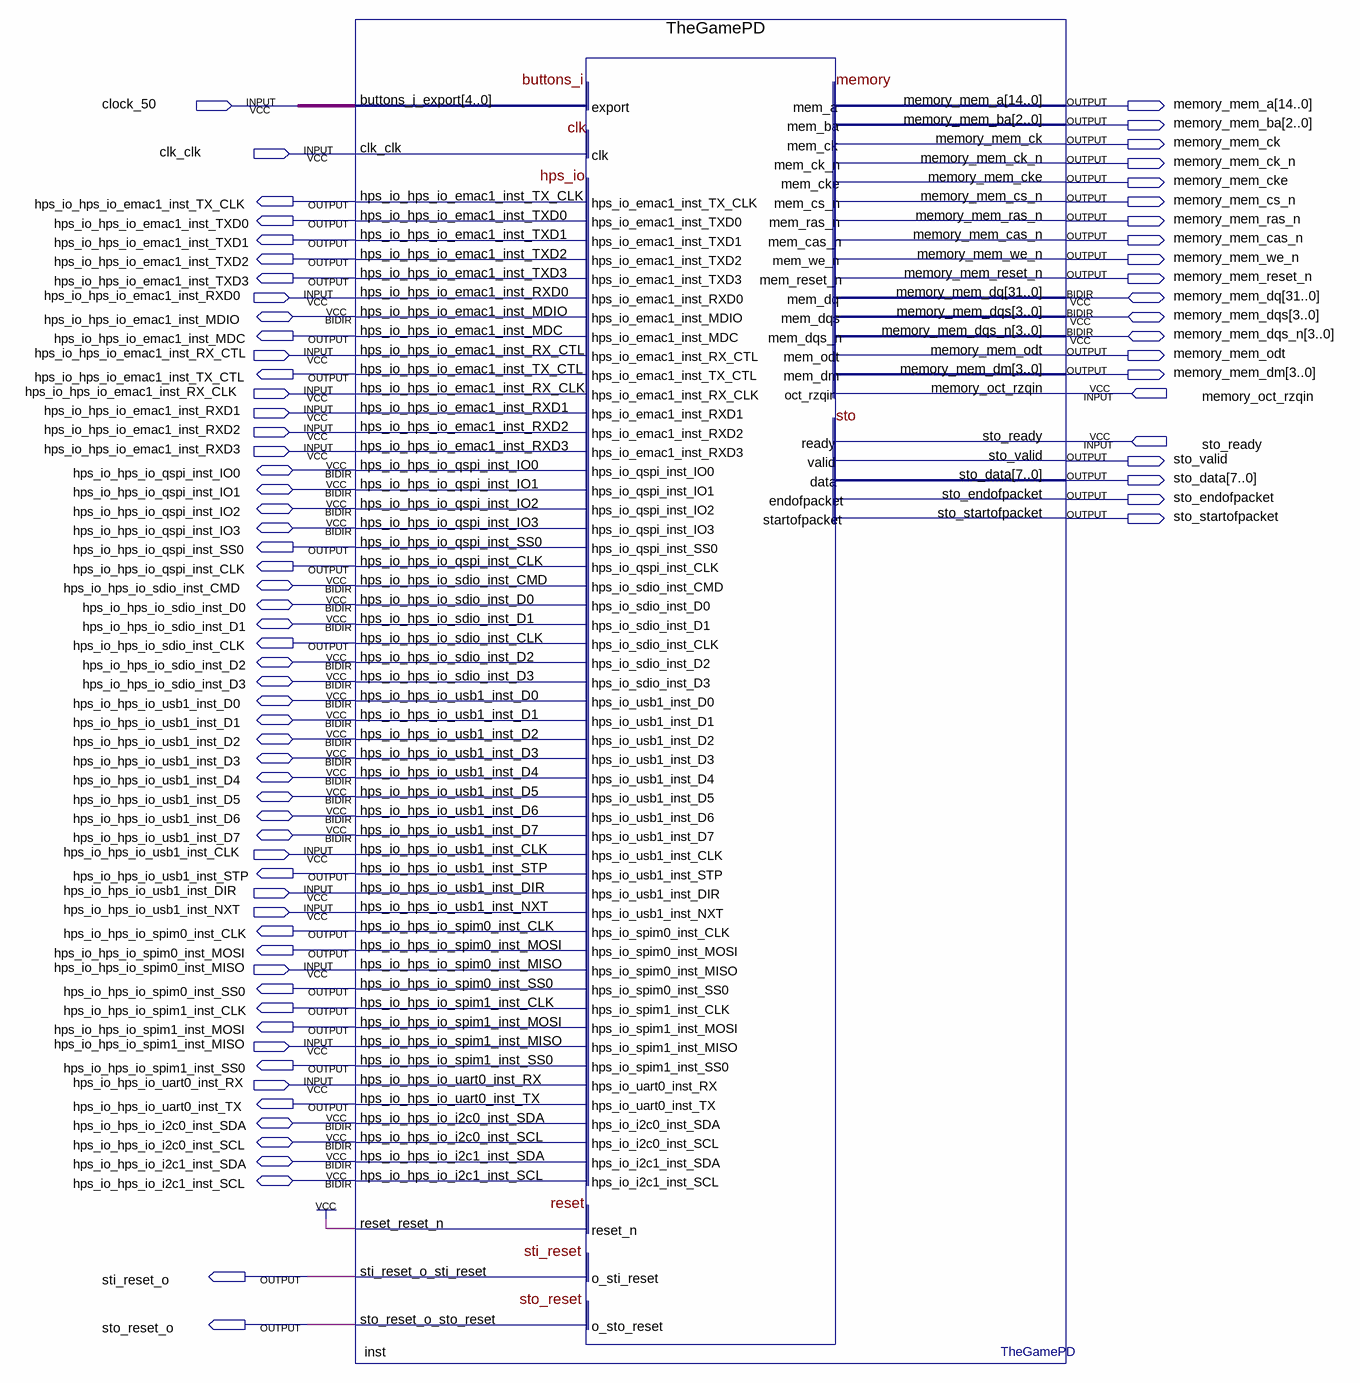
[diagram p0: schematic sheet]
// Quartus schematic theGame.bdf as structural Verilog: 1 symbols, 77 pins
module theGame (
  input  clock_50,
  input  clk_clk,
  input  hps_io_hps_io_emac1_inst_RXD0,
  input  hps_io_hps_io_emac1_inst_RX_CTL,
  input  hps_io_hps_io_emac1_inst_RX_CLK,
  input  memory_oct_rzqin,
  input  hps_io_hps_io_emac1_inst_RXD1,
  input  hps_io_hps_io_emac1_inst_RXD2,
  input  sto_ready,
  input  hps_io_hps_io_emac1_inst_RXD3,
  input  hps_io_hps_io_usb1_inst_CLK,
  input  hps_io_hps_io_usb1_inst_DIR,
  input  hps_io_hps_io_usb1_inst_NXT,
  input  hps_io_hps_io_spim0_inst_MISO,
  input  hps_io_hps_io_spim1_inst_MISO,
  input  hps_io_hps_io_uart0_inst_RX,
  inout  [31:0] memory_mem_dq,
  inout  hps_io_hps_io_emac1_inst_MDIO,
  inout  [3:0] memory_mem_dqs,
  inout  [3:0] memory_mem_dqs_n,
  inout  hps_io_hps_io_qspi_inst_IO0,
  inout  hps_io_hps_io_qspi_inst_IO1,
  inout  hps_io_hps_io_qspi_inst_IO2,
  inout  hps_io_hps_io_qspi_inst_IO3,
  inout  hps_io_hps_io_sdio_inst_CMD,
  inout  hps_io_hps_io_sdio_inst_D0,
  inout  hps_io_hps_io_sdio_inst_D1,
  inout  hps_io_hps_io_sdio_inst_D2,
  inout  hps_io_hps_io_sdio_inst_D3,
  inout  hps_io_hps_io_usb1_inst_D0,
  inout  hps_io_hps_io_usb1_inst_D1,
  inout  hps_io_hps_io_usb1_inst_D2,
  inout  hps_io_hps_io_usb1_inst_D3,
  inout  hps_io_hps_io_usb1_inst_D4,
  inout  hps_io_hps_io_usb1_inst_D5,
  inout  hps_io_hps_io_usb1_inst_D6,
  inout  hps_io_hps_io_usb1_inst_D7,
  inout  hps_io_hps_io_i2c0_inst_SDA,
  inout  hps_io_hps_io_i2c0_inst_SCL,
  inout  hps_io_hps_io_i2c1_inst_SDA,
  inout  hps_io_hps_io_i2c1_inst_SCL,
  output [14:0] memory_mem_a,
  output [2:0] memory_mem_ba,
  output memory_mem_ck,
  output memory_mem_ck_n,
  output memory_mem_cke,
  output hps_io_hps_io_emac1_inst_TX_CLK,
  output memory_mem_cs_n,
  output hps_io_hps_io_emac1_inst_TXD0,
  output memory_mem_ras_n,
  output hps_io_hps_io_emac1_inst_TXD1,
  output memory_mem_cas_n,
  output hps_io_hps_io_emac1_inst_TXD2,
  output memory_mem_we_n,
  output hps_io_hps_io_emac1_inst_TXD3,
  output memory_mem_reset_n,
  output hps_io_hps_io_emac1_inst_MDC,
  output memory_mem_odt,
  output hps_io_hps_io_emac1_inst_TX_CTL,
  output [3:0] memory_mem_dm,
  output sto_valid,
  output [7:0] sto_data,
  output sto_endofpacket,
  output sto_startofpacket,
  output hps_io_hps_io_qspi_inst_SS0,
  output hps_io_hps_io_qspi_inst_CLK,
  output hps_io_hps_io_sdio_inst_CLK,
  output hps_io_hps_io_usb1_inst_STP,
  output hps_io_hps_io_spim0_inst_CLK,
  output hps_io_hps_io_spim0_inst_MOSI,
  output hps_io_hps_io_spim0_inst_SS0,
  output hps_io_hps_io_spim1_inst_CLK,
  output hps_io_hps_io_spim1_inst_MOSI,
  output hps_io_hps_io_spim1_inst_SS0,
  output hps_io_hps_io_uart0_inst_TX,
  output sti_reset_o,
  output sto_reset_o
);

  wire [4:0] undriven;

  TheGamePD inst (
    .buttons_i_export(undriven), .clk_clk(clk_clk),
    .hps_io_hps_io_emac1_inst_RXD0(hps_io_hps_io_emac1_inst_RXD0),
    .hps_io_hps_io_emac1_inst_RX_CTL(hps_io_hps_io_emac1_inst_RX_CTL),
    .hps_io_hps_io_emac1_inst_RX_CLK(hps_io_hps_io_emac1_inst_RX_CLK),
    .hps_io_hps_io_emac1_inst_RXD1(hps_io_hps_io_emac1_inst_RXD1),
    .hps_io_hps_io_emac1_inst_RXD2(hps_io_hps_io_emac1_inst_RXD2),
    .hps_io_hps_io_emac1_inst_RXD3(hps_io_hps_io_emac1_inst_RXD3),
    .hps_io_hps_io_usb1_inst_CLK(hps_io_hps_io_usb1_inst_CLK),
    .hps_io_hps_io_usb1_inst_DIR(hps_io_hps_io_usb1_inst_DIR),
    .hps_io_hps_io_usb1_inst_NXT(hps_io_hps_io_usb1_inst_NXT),
    .hps_io_hps_io_spim0_inst_MISO(hps_io_hps_io_spim0_inst_MISO),
    .hps_io_hps_io_spim1_inst_MISO(hps_io_hps_io_spim1_inst_MISO),
    .hps_io_hps_io_uart0_inst_RX(hps_io_hps_io_uart0_inst_RX), .memory_oct_rzqin(memory_oct_rzqin),
    .reset_reset_n(1'b1), .sto_ready(sto_ready),
    .hps_io_hps_io_emac1_inst_TX_CLK(hps_io_hps_io_emac1_inst_TX_CLK),
    .hps_io_hps_io_emac1_inst_TXD0(hps_io_hps_io_emac1_inst_TXD0),
    .hps_io_hps_io_emac1_inst_TXD1(hps_io_hps_io_emac1_inst_TXD1),
    .hps_io_hps_io_emac1_inst_TXD2(hps_io_hps_io_emac1_inst_TXD2),
    .hps_io_hps_io_emac1_inst_TXD3(hps_io_hps_io_emac1_inst_TXD3),
    .hps_io_hps_io_emac1_inst_MDC(hps_io_hps_io_emac1_inst_MDC),
    .hps_io_hps_io_emac1_inst_TX_CTL(hps_io_hps_io_emac1_inst_TX_CTL),
    .hps_io_hps_io_qspi_inst_SS0(hps_io_hps_io_qspi_inst_SS0),
    .hps_io_hps_io_qspi_inst_CLK(hps_io_hps_io_qspi_inst_CLK),
    .hps_io_hps_io_sdio_inst_CLK(hps_io_hps_io_sdio_inst_CLK),
    .hps_io_hps_io_usb1_inst_STP(hps_io_hps_io_usb1_inst_STP),
    .hps_io_hps_io_spim0_inst_CLK(hps_io_hps_io_spim0_inst_CLK),
    .hps_io_hps_io_spim0_inst_MOSI(hps_io_hps_io_spim0_inst_MOSI),
    .hps_io_hps_io_spim0_inst_SS0(hps_io_hps_io_spim0_inst_SS0),
    .hps_io_hps_io_spim1_inst_CLK(hps_io_hps_io_spim1_inst_CLK),
    .hps_io_hps_io_spim1_inst_MOSI(hps_io_hps_io_spim1_inst_MOSI),
    .hps_io_hps_io_spim1_inst_SS0(hps_io_hps_io_spim1_inst_SS0),
    .hps_io_hps_io_uart0_inst_TX(hps_io_hps_io_uart0_inst_TX), .memory_mem_a(memory_mem_a),
    .memory_mem_ba(memory_mem_ba), .memory_mem_ck(memory_mem_ck), .memory_mem_ck_n(memory_mem_ck_n),
    .memory_mem_cke(memory_mem_cke), .memory_mem_cs_n(memory_mem_cs_n), .memory_mem_ras_n(memory_mem_ras_n),
    .memory_mem_cas_n(memory_mem_cas_n), .memory_mem_we_n(memory_mem_we_n),
    .memory_mem_reset_n(memory_mem_reset_n), .memory_mem_odt(memory_mem_odt), .memory_mem_dm(memory_mem_dm),
    .sti_reset_o_sti_reset(sti_reset_o), .sto_valid(sto_valid), .sto_data(sto_data),
    .sto_endofpacket(sto_endofpacket), .sto_startofpacket(sto_startofpacket),
    .sto_reset_o_sto_reset(sto_reset_o), .hps_io_hps_io_emac1_inst_MDIO(hps_io_hps_io_emac1_inst_MDIO),
    .hps_io_hps_io_qspi_inst_IO0(hps_io_hps_io_qspi_inst_IO0),
    .hps_io_hps_io_qspi_inst_IO1(hps_io_hps_io_qspi_inst_IO1),
    .hps_io_hps_io_qspi_inst_IO2(hps_io_hps_io_qspi_inst_IO2),
    .hps_io_hps_io_qspi_inst_IO3(hps_io_hps_io_qspi_inst_IO3),
    .hps_io_hps_io_sdio_inst_CMD(hps_io_hps_io_sdio_inst_CMD),
    .hps_io_hps_io_sdio_inst_D0(hps_io_hps_io_sdio_inst_D0),
    .hps_io_hps_io_sdio_inst_D1(hps_io_hps_io_sdio_inst_D1),
    .hps_io_hps_io_sdio_inst_D2(hps_io_hps_io_sdio_inst_D2),
    .hps_io_hps_io_sdio_inst_D3(hps_io_hps_io_sdio_inst_D3),
    .hps_io_hps_io_usb1_inst_D0(hps_io_hps_io_usb1_inst_D0),
    .hps_io_hps_io_usb1_inst_D1(hps_io_hps_io_usb1_inst_D1),
    .hps_io_hps_io_usb1_inst_D2(hps_io_hps_io_usb1_inst_D2),
    .hps_io_hps_io_usb1_inst_D3(hps_io_hps_io_usb1_inst_D3),
    .hps_io_hps_io_usb1_inst_D4(hps_io_hps_io_usb1_inst_D4),
    .hps_io_hps_io_usb1_inst_D5(hps_io_hps_io_usb1_inst_D5),
    .hps_io_hps_io_usb1_inst_D6(hps_io_hps_io_usb1_inst_D6),
    .hps_io_hps_io_usb1_inst_D7(hps_io_hps_io_usb1_inst_D7),
    .hps_io_hps_io_i2c0_inst_SDA(hps_io_hps_io_i2c0_inst_SDA),
    .hps_io_hps_io_i2c0_inst_SCL(hps_io_hps_io_i2c0_inst_SCL),
    .hps_io_hps_io_i2c1_inst_SDA(hps_io_hps_io_i2c1_inst_SDA),
    .hps_io_hps_io_i2c1_inst_SCL(hps_io_hps_io_i2c1_inst_SCL), .memory_mem_dq(memory_mem_dq),
    .memory_mem_dqs(memory_mem_dqs), .memory_mem_dqs_n(memory_mem_dqs_n));
endmodule
